# EAGLE schematic LED_Ring_v8 (EAGLE 9.7.0)
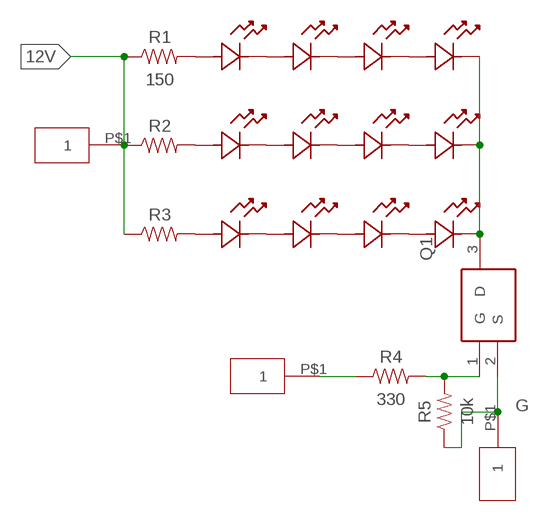
[diagram p0: schematic, sheet 1]

## Parts
LED5  GW_JTLMS1.EM-GWH4-XX53-1-60-R3LED_SMT-GWJTLMS1.EM_AOS  [LED_SMT-GWJTLMS1.EM_AOS]
LED6  GW_JTLMS1.EM-GWH4-XX53-1-60-R3LED_SMT-GWJTLMS1.EM_AOS  [LED_SMT-GWJTLMS1.EM_AOS]
LED7  GW_JTLMS1.EM-GWH4-XX53-1-60-R3LED_SMT-GWJTLMS1.EM_AOS  [LED_SMT-GWJTLMS1.EM_AOS]
LED8  GW_JTLMS1.EM-GWH4-XX53-1-60-R3LED_SMT-GWJTLMS1.EM_AOS  [LED_SMT-GWJTLMS1.EM_AOS]
LED9  GW_JTLMS1.EM-GWH4-XX53-1-60-R3LED_SMT-GWJTLMS1.EM_AOS  [LED_SMT-GWJTLMS1.EM_AOS]
LED10  GW_JTLMS1.EM-GWH4-XX53-1-60-R3LED_SMT-GWJTLMS1.EM_AOS  [LED_SMT-GWJTLMS1.EM_AOS]
LED11  GW_JTLMS1.EM-GWH4-XX53-1-60-R3LED_SMT-GWJTLMS1.EM_AOS  [LED_SMT-GWJTLMS1.EM_AOS]
LED12  GW_JTLMS1.EM-GWH4-XX53-1-60-R3LED_SMT-GWJTLMS1.EM_AOS  [LED_SMT-GWJTLMS1.EM_AOS]
LED13  GW_JTLMS1.EM-GWH4-XX53-1-60-R3LED_SMT-GWJTLMS1.EM_AOS  [LED_SMT-GWJTLMS1.EM_AOS]
LED14  GW_JTLMS1.EM-GWH4-XX53-1-60-R3LED_SMT-GWJTLMS1.EM_AOS  [LED_SMT-GWJTLMS1.EM_AOS]
LED15  GW_JTLMS1.EM-GWH4-XX53-1-60-R3LED_SMT-GWJTLMS1.EM_AOS  [LED_SMT-GWJTLMS1.EM_AOS]
LED16  GW_JTLMS1.EM-GWH4-XX53-1-60-R3LED_SMT-GWJTLMS1.EM_AOS  [LED_SMT-GWJTLMS1.EM_AOS]
Q1  IRLML6244TRPBF  [SOT95P237X112-3N]
R1  150  R-US_CHIP-0402(1005-METRIC)  [RESC1005X40]
R2  R-US_CHIP-0402(1005-METRIC)  [RESC1005X40]
R3  R-US_CHIP-0402(1005-METRIC)  [RESC1005X40]
R4  330  R-US_CHIP-0402(1005-METRIC)  [RESC1005X40]
R5  10k  R-US_CHIP-0402(1005-METRIC)  [RESC1005X40]
U$1  SOLDER_PAD_HOLE  [SOLDER_PAD_HOLE]
U$2  SOLDER_PAD_HOLE  [SOLDER_PAD_HOLE]
U$3  SOLDER_PAD_HOLE  [SOLDER_PAD_HOLE]

## Nets
12V: R1.1 R2.1 R3.1 U$1.P$1
G: Q1.2(S) R5.1 U$2.P$1
GND: LED8.1 LED12.1 LED16.1 Q1.3(D)
N$1: Q1.1(G) R4.2 R5.2
N$2: R4.1 U$3.P$1
N$4: LED5.1 LED6.2
N$5: LED6.1 LED7.2
N$6: LED7.1 LED8.2
N$7: LED9.1 LED10.2
N$8: LED10.1 LED11.2
N$9: LED11.1 LED12.2
N$10: LED13.1 LED14.2
N$11: LED14.1 LED15.2
N$12: LED15.1 LED16.2
N$13: LED13.2 R1.2
N$14: LED9.2 R2.2
N$15: LED5.2 R3.2

## Library data of the parts
LED5-LED16 = PNP:GW_JTLMS1.EM-GWH4-XX53-1-60-R3; COPYRIGHT: Copyright (C) 2025 Ultra Librarian. All rights reserved.; MANUFACTURER_PART_NUMBER: GW JTLMS1.EM-GWH4-XX53-1-60-R33; MFR_NAME: ams OSRAM
Q1 = PNP:IRLML6244TRPBF: INFINEON - IRLML6244TRPBF - MOSFET, N CH, 20V, 6.3A, SOT-23 Source: Datasheet <http://www.infineon.com/dgdl/irlml6244pbf.pdf?fileId=5546d462533600a4015356686fed261f>; DESCRIPTION: INFINEON - IRLML6244TRPBF - MOSFET, N CH, 20V, 6.3A, SOT-23; HEIGHT: 1.12mm; MANUFACTURER_NAME: Infineon; MANUFACTURER_PART_NUMBER: IRLML6244TRPBF; MOUSER_PART_NUMBER: 942-IRLML6244TRPBF; MOUSER_PRICE-STOCK: https://www.mouser.co.uk/ProductDetail/Infineon-Technologies/IRLML6244TRPBF?qs=9%252BKlkBgLFf1HkY%2F2U%252BIhLQ%3D%3D
R1-R5 = Resistor:R-US: Resistor Fixed - ANSI; CATEGORY: Resistors; DESCRIPTION: Chip Resistor 1.05 X 0.54 X 0.40 mm body 0402(1005-METRIC) Package; PACKAGE_SIZE: 0402; PACKAGE_TYPE: SMD
U$1-U$3 = PressHeater:SOLDER_PAD_HOLE